# Altium schematic sheet Sheet1.SchDoc
size A
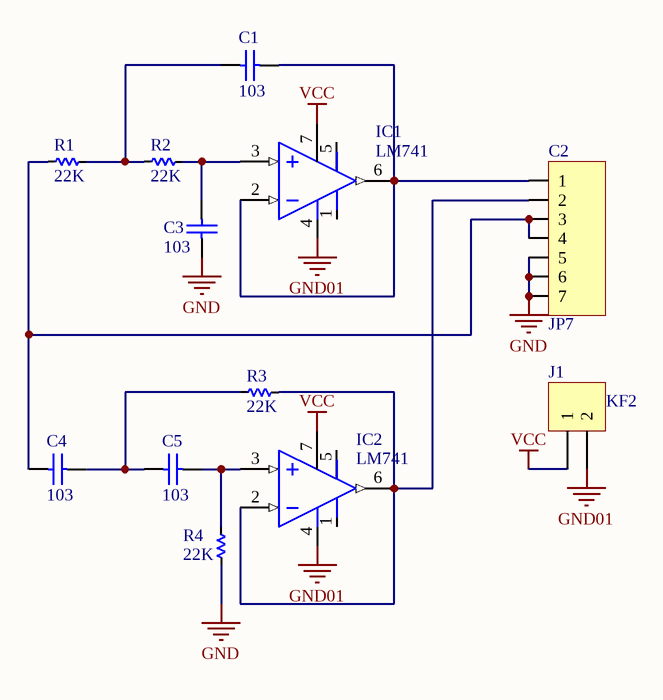
[diagram p0: Sheet1.SchDoc]

## Parts
C1  value 103  [Cap Non-Pol 3mm]  (hidden comment: Cap Non-pol)
C2  JP7  [JP7-D1T]
C3  value 103  [Cap Non-Pol 3mm]  (hidden comment: Cap Non-pol)
C4  value 103  [Cap Non-Pol 3mm]  (hidden comment: Cap Non-pol)
C5  value 103  [Cap Non-Pol 3mm]  (hidden comment: Cap Non-pol)
IC1  LM741  [DIP8]
IC2  LM741  [DIP8]
J1  KF2  [KF2-3.5]
R1  22K  [RES-1/4W]
R2  22K  [RES-1/4W]
R3  22K  [RES-1/4W]
R4  22K  [RES-1/4W]

## Nets
GND: C2.5 C2.6 C2.7 C3.1 R4.2
GND01: IC1.4(-V) IC2.4(-V) J1.2
VCC: IC1.7(+V) IC2.7(+V) J1.1
NetC1_1: C1.1 R1.1 R2.2
NetC1_2: C1.2 C2.1 IC1.2(IN-) IC1.6(OUT)
NetC2_2: C2.2 IC2.2(IN-) IC2.6(OUT) R3.1
NetC2_3: C2.3 C2.4 C4.1 R1.2
NetC3_2: C3.2 IC1.3(IN+) R2.1
NetC4_2: C4.2 C5.1 R3.2
NetC5_2: C5.2 IC2.3(IN+) R4.1

Not connected (* = marked no-connect by the designer): IC1 1(Vos) 5(Vos); IC2 1(Vos) 5(Vos)

## Library data of the parts
C1 C3-C5 = Cap Non-pol: Non-polarized Capacitor; Published: 8-Jun-2000; LatestRevisionDate: 17-Jul-2002; LatestRevisionNote: Re-released for DXP Platform.; PackageReference: RAD-0.3; Publisher: Altium Limited
C2 = JP7: WR-PHD 2.54 mm Angled Socket Header; Manufacturer: W¨¹rth Elektronik eiSos GmbH; partNo: 613007143121; ComponentLink1 Description: Manufacturer; ComponentLink2 Description: Datasheet; NoPins: 07; Created Date: 29 March 2013; ComponentLink1URL: http://www.we-online.com; ComponentLink2URL: http://katalog.we-online.de/em/datasheet/6130xx143121.pdf; Created by: Karrer Zheng
IC1 IC2 = LM741: Single OA
J1 = KF2: Manufacturer: Würth Elektronik eiSos GmbH; partNo: 691103110002; ComponentLink1 Description: Manufacturer; ComponentLink2 Description: Datasheet; NoPins: 2; Created Date: 29 October 2013; ComponentLink1URL: http://www.we-online.com; ComponentLink2URL: http://katalog.we-online.de/em/datasheet/6911031100xx.pdf; Created by: Karrer Zheng
R1-R4 = Res: Manufacturer: Generic Components; Class: Passive; SubClass: R; Published: 08/06/2000; Publisher: Altium Hobart Technology Centre